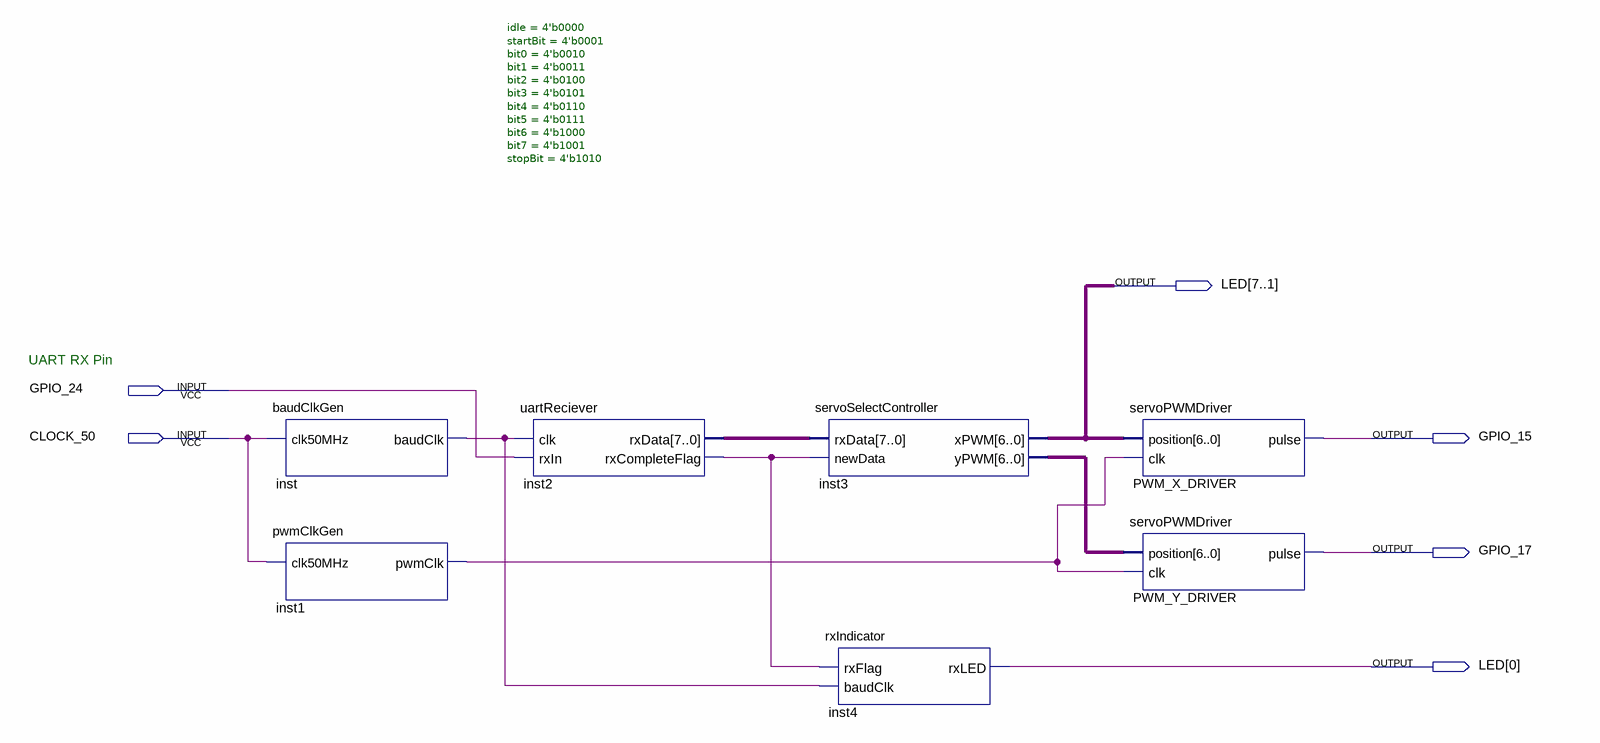
[diagram p0: schematic sheet]
// Quartus schematic FPGA_UART_Servo_Controller.bdf as structural Verilog: 7 symbols, 6 pins
module FPGA_UART_Servo_Controller (
  input  GPIO_24,
  input  CLOCK_50,
  output [7:0] LED,
  output GPIO_15,
  output GPIO_17
);

  wire inst1_pwmclk, inst2_rxcompleteflag, inst_baudclk;
  wire [6:0] inst3_ypwm;
  wire [7:0] inst2_rxdata;

  baudClkGen inst (.clk50MHz(CLOCK_50), .baudClk(inst_baudclk));
  pwmClkGen inst1 (.clk50MHz(CLOCK_50), .pwmClk(inst1_pwmclk));
  uartReciever #(.idle(4'b0000), .startBit(4'b0001), .bit0(4'b0010), .bit1(4'b0011), .bit2(4'b0100), .bit3(4'b0101), .bit4(4'b0110), .bit5(4'b0111), .bit6(4'b1000), .bit7(4'b1001), .stopBit(4'b1010)) inst2 (
    .clk(inst_baudclk), .rxIn(GPIO_24), .rxData(inst2_rxdata), .rxCompleteFlag(inst2_rxcompleteflag));
  servoSelectController inst3 (
    .rxData(inst2_rxdata), .newData(inst2_rxcompleteflag), .xPWM(LED[7:1]), .yPWM(inst3_ypwm));
  rxIndicator inst4 (.rxFlag(inst2_rxcompleteflag), .baudClk(inst_baudclk), .rxLED(LED[0]));
  servoPWMDriver PWM_X_DRIVER (.position(LED[7:1]), .clk(inst1_pwmclk), .pulse(GPIO_15));
  servoPWMDriver PWM_Y_DRIVER (.position(inst3_ypwm), .clk(inst1_pwmclk), .pulse(GPIO_17));

  // Notes on the sheet:
  //   UART RX Pin
endmodule
